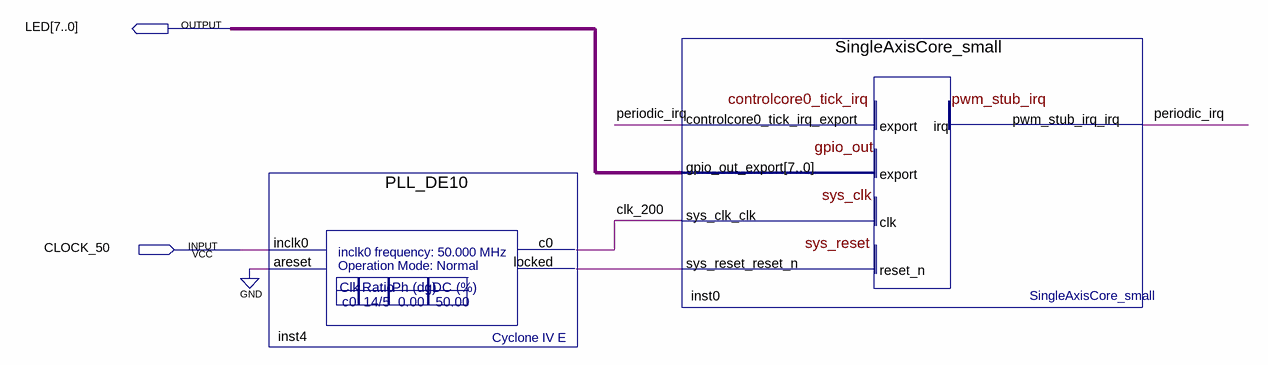
[diagram p0: schematic sheet]
// Quartus schematic TopLevel.bdf as structural Verilog: 2 symbols, 2 pins
module TopLevel (
  input  CLOCK_50,
  output [7:0] LED
);

  wire clk_200, inst4_locked, periodic_irq;

  PLL_DE10 inst4 (.inclk0(CLOCK_50), .areset(1'b0), .c0(clk_200), .locked(inst4_locked));
  SingleAxisCore_small inst0 (
    .controlcore0_tick_irq_export(periodic_irq), .sys_clk_clk(clk_200), .sys_reset_reset_n(inst4_locked),
    .gpio_out_export(LED), .pwm_stub_irq_irq(periodic_irq));
endmodule
